# EAGLE design sao-flipper (EAGLE 9.0.1)
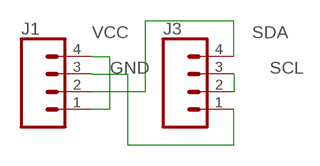
[diagram p0: schematic, sheet 1]

## Parts
J1  CONN_04LOCK  [1X04_LOCK]
J3  CONN_04LOCK  [1X04_LOCK]

## Nets
GND: J1.3 J3.1
SCL: J3.2 J3.3
SDA: J1.2 J3.4
VCC: J1.1 J1.4

## Library data of the parts
J1 J3 = SparkFun-Connectors:CONN_04: Multi connection point. Often used as Generic Header-pin footprint for 0.1 inch spaced/style header connections On any of the 0.1 inch spaced packages, you can populate with these: Break Away Headers - Straight <https://www.sparkfun.com/products/116> (PRT-00116) Break Away Male Headers - Right Angle <https://www.sparkfun.com/products/553> (PRT-00553) Female Headers <https://www.sparkfun.com/products/115> (PRT-00115) Break Away Headers - Machine Pin <https://www.sparkfun.com/products/117> (PRT-00117) Break Away Female Headers - Swiss Machine Pin <https://www.sparkfun.com/products/743> (PRT-00743) For SCREWTERMINALS and SPRING TERMINALS visit here: Screw Terimnals on SparkFun.com <https://www.sparkfun.com/search/results?term=Screw+Terminals> (5mm/3.5mm/2.54mm spacing) This device is also useful as a general connection point to wire up your design to another part of your project. Our various solder wires solder well into these plated through hole pads. Hook-Up Wire - Assortment (Stranded, 22 AWG) <https://www.sparkfun.com/products/11375> (PRT-11375) Hook-Up Wire - Assortment (Solid Core, 22 AWG) <https://www.sparkfun.com/products/11367> (PRT-11367) View the entire wire category on our website here <https://www.sparkfun.com/categories/141> Special notes: Molex polarized connector foot print use with SKU : PRT-08231 with associated crimp pins and housings. 1MM SMD Version SKU: PRT-10208; PROD_ID: CONN-09696

## Board
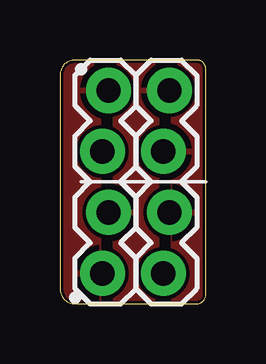
[diagram p1: board, top side]
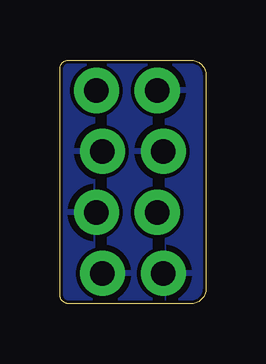
[diagram p2: board, bottom side, seen from below]

Size 6.1 x 10.16 mm. Coordinates in mm from the lower left corner, seen from the top.
Outline: 6.1,0.38 6.1,9.78 arc90 5.71,10.16 0.64,10.16 arc90 0,9.53 0,0.64 arc90 0.64,0 5.71,0 arc90 6.1,0.38
Copper layers (1*16): Top 0.035mm / dielectric 1.5mm / Bottom 0.035mm
Design rules "default *": minimum track width 6mil, minimum drill 0.35mm, track to track 6mil, track to pad 6mil, pad to pad 6mil, via to via 6mil, smd to smd 6mil, copper to edge 5mil, drill to drill 6mil, minimum pad ring 10mil, minimum via ring 8mil, stop-mask expansion 4mil, vias tented up to drill 0mil, thermal gap 10mil

### Footprints (pad centres in the part's own frame; a part is rotated, then mirrored left to right if it is on the bottom)
1X04_LOCK = drill 1.016 pad 1.88: 1 0,0.127; 2 2.54,-0.127; 3 5.08,0.127; 4 7.62,-0.127

### Placement (x,y rotation side)
J1  1.91,1.27 90 top
J3  4.44,1.27 90 top

### Tracks (layer width: path | path; a pad name or v marks a point on that pad's centre or on a via)
GND
  pour Bottom: 4.06,0 4.06,11.43 2.29,11.43 2.29,0
SCL
  pour Bottom: 4.7,-1.27 4.7,11.43 8.26,11.43 8.26,-1.27
  pour Top: 4.7,-1.27 4.7,11.43 8.26,11.43 8.26,-1.27
SDA
  pour Top: 4.06,0 4.06,11.43 2.29,11.43 2.29,0
VCC
  pour Bottom: -1.91,-1.27 -1.91,11.43 1.65,11.43 1.65,-1.27
  pour Top: -1.91,-1.27 -1.91,11.43 1.65,11.43 1.65,-1.27

### Text on the board
tStop: git.io/sao-rotate
bStop: rotate SAO 45 degrees